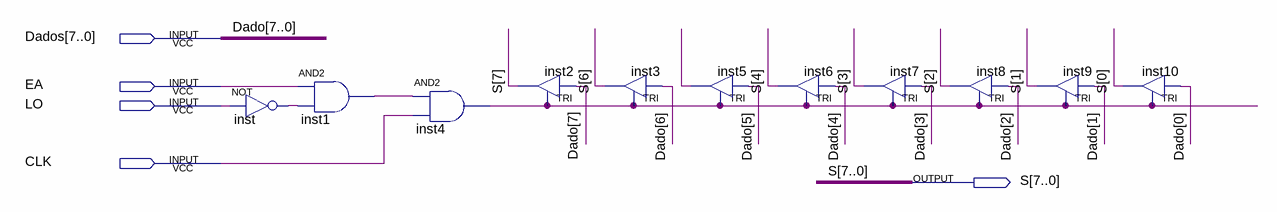
[diagram p0: schematic sheet]
// Quartus schematic RegistradorSaida.bdf as structural Verilog: 11 symbols, 5 pins
module RegistradorSaida (
  input  [7:0] Dados,
  input  EA,
  input  LO,
  input  CLK,
  output [7:0] S
);

  wire inst1_out, inst4_out, inst5_out, inst_out;

  not inst (inst_out, LO);
  and inst1 (inst1_out, EA, inst_out);
  and inst4 (inst4_out, inst1_out, CLK);
  TRI inst2 (.IN(Dados[7]), .OE(inst4_out), .OUT(S[7]));
  TRI inst3 (.IN(Dados[6]), .OE(inst4_out), .OUT(S[6]));
  TRI inst5 (.IN(Dados[5]), .OE(inst4_out), .OUT(inst5_out));
  TRI inst6 (.IN(Dados[4]), .OE(inst4_out), .OUT(S[4]));
  TRI inst7 (.IN(Dados[3]), .OE(inst4_out), .OUT(S[3]));
  TRI inst8 (.IN(Dados[2]), .OE(inst4_out), .OUT(S[2]));
  TRI inst9 (.IN(Dados[1]), .OE(inst4_out), .OUT(S[1]));
  TRI inst10 (.IN(Dados[0]), .OE(inst4_out), .OUT(S[0]));

  // Other names for the same wires on the sheet: Dado[7:0] = Dados
endmodule
